# Altium schematic sheet Sensor Signal.SchDoc
size A2; SheetNumber: 2; SheetTotal: 3
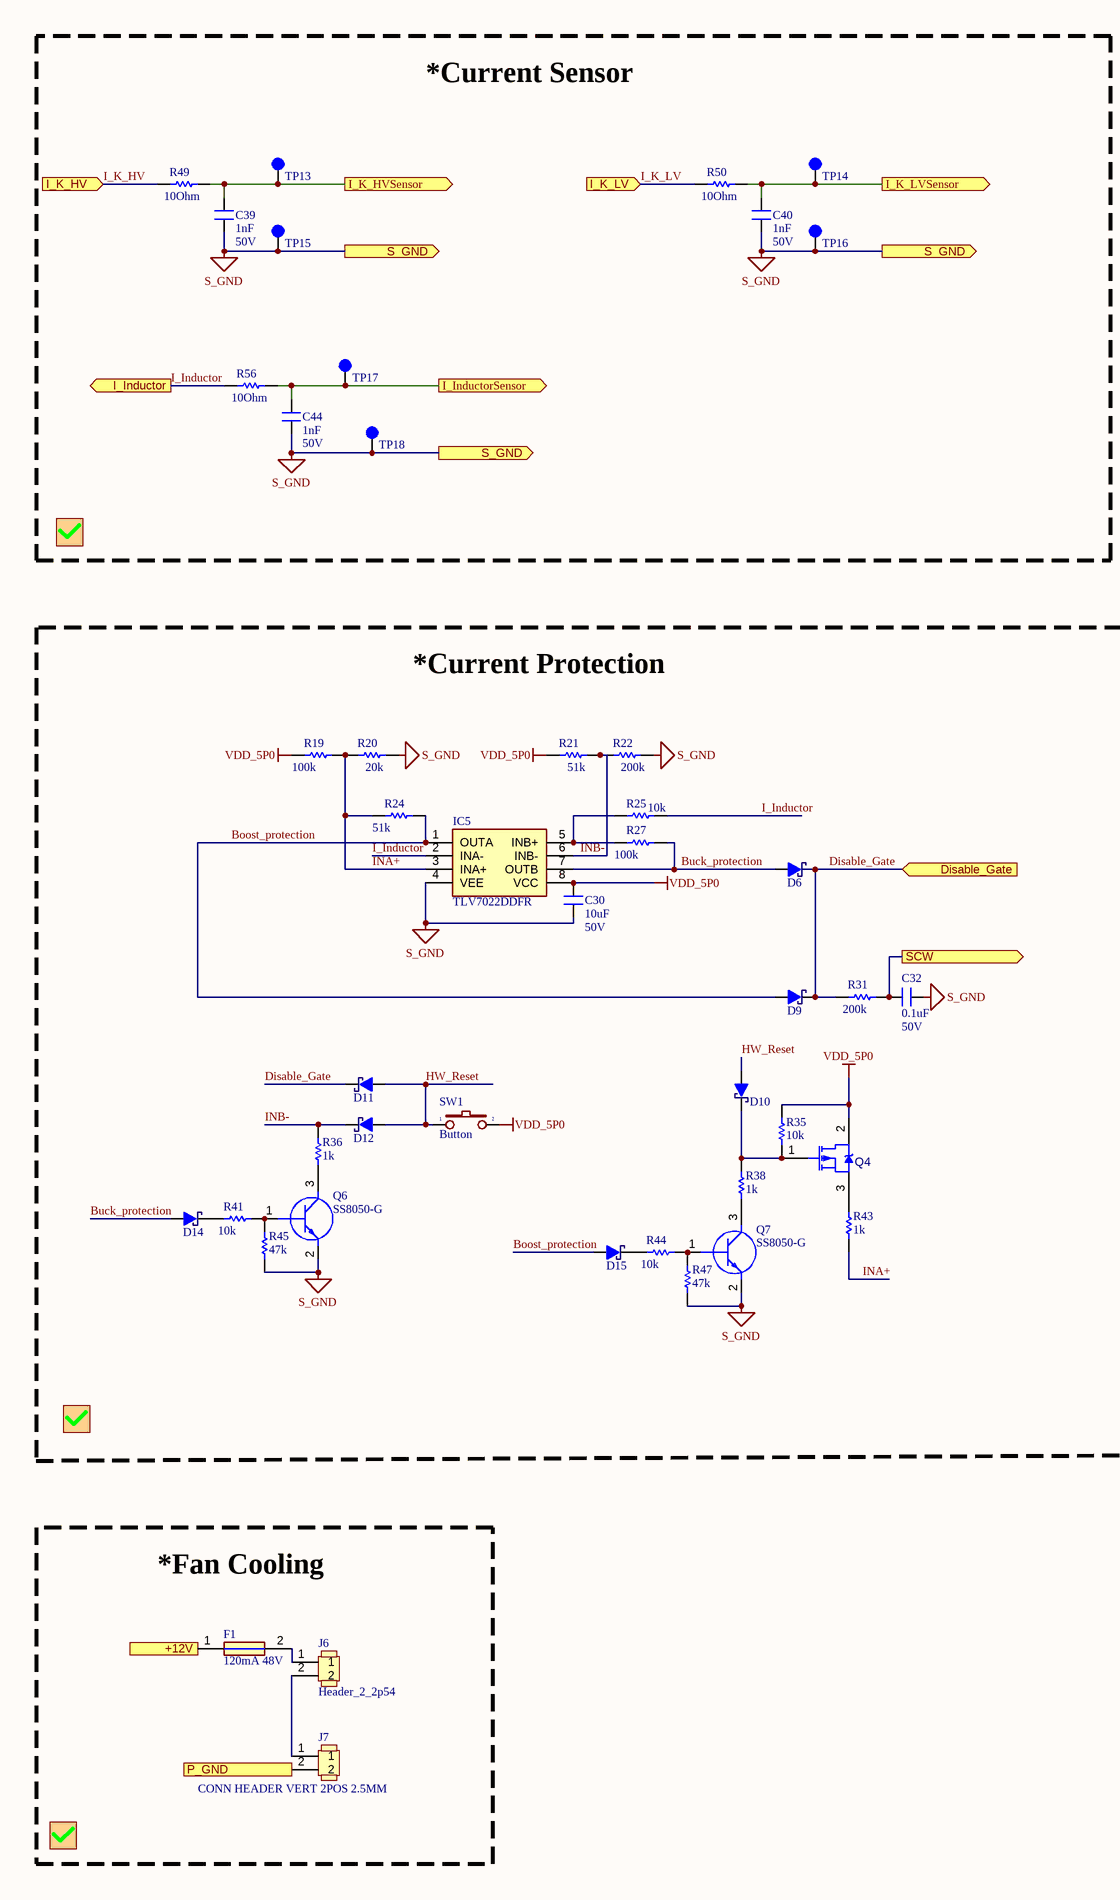
[diagram p0: Sensor Signal.SchDoc, left]
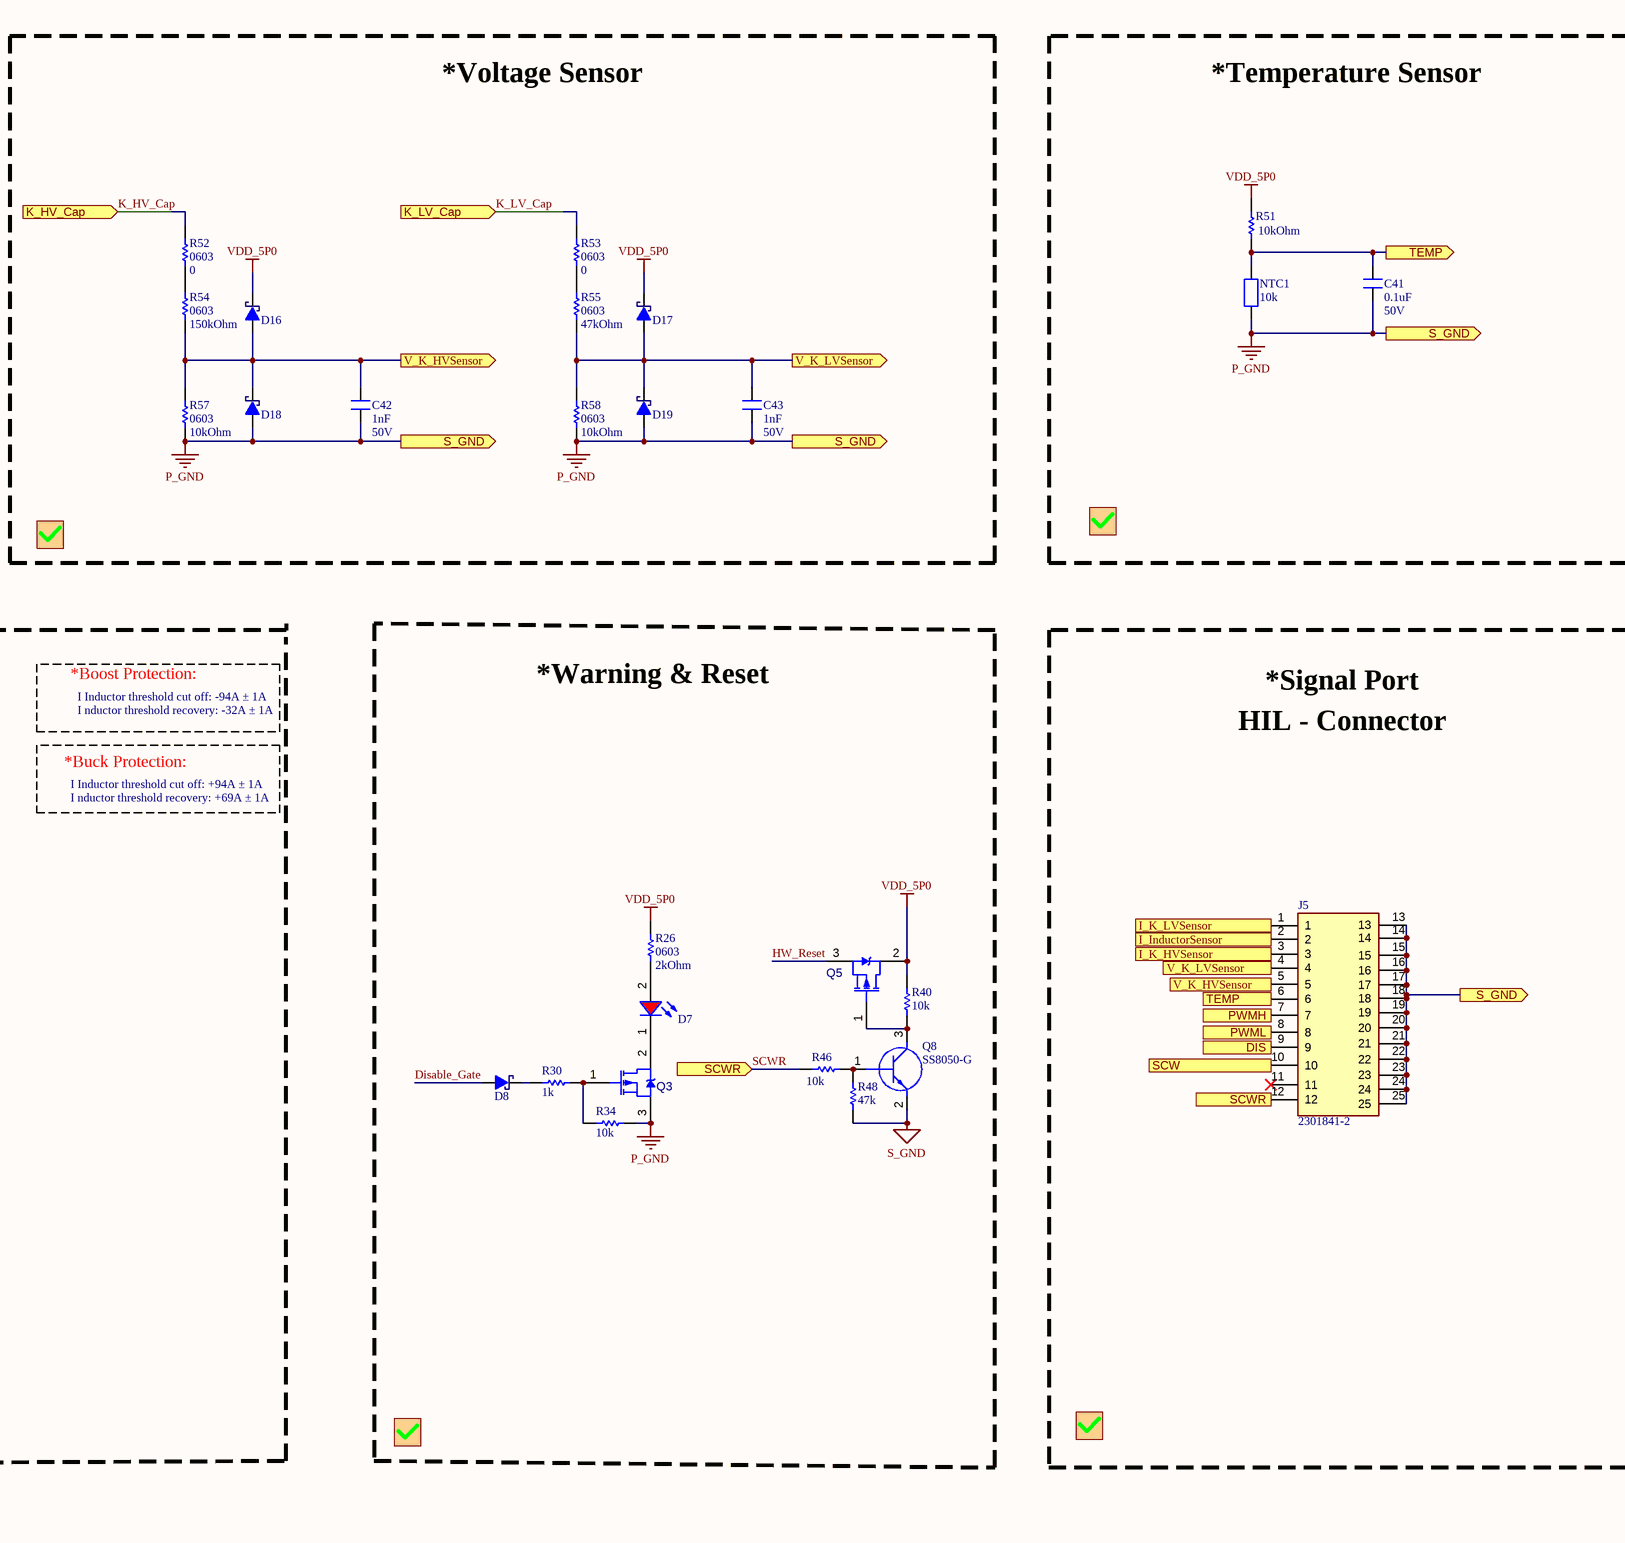
[diagram p1: Sensor Signal.SchDoc, right]

## Parts
C30  10uF  value 50V  [C_0603]
C32  0.1uF  value 50V  [C_0603]
C39  1nF  value 50V  [C_0603]
C40  1nF  value 50V  [C_0603]
C41  0.1uF  value 50V  [C_0603]
C42  1nF  value 50V  [C_0603]
C43  1nF  value 50V  [C_0603]
C44  1nF  value 50V  [C_0603]
D6  PMEG2010AEJ,115  [SOD323F]  (value not drawn)
D7  LED-SMD  [SM-LED-0805-Red]  (value not drawn)
D8  PMEG2010AEJ,115  [SOD323F]  (value not drawn)
D9  PMEG2010AEJ,115  [SOD323F]  (value not drawn)
D10  PMEG2010AEJ,115  [SOD323F]  (value not drawn)
D11  PMEG2010AEJ,115  [SOD323F]  (value not drawn)
D12  PMEG2010AEJ,115  [SOD323F]  (value not drawn)
D14  PMEG2010AEJ,115  [SOD323F]  (value not drawn)
D15  PMEG2010AEJ,115  [SOD323F]  (value not drawn)
D16  PMEG2010AEJ,115  [SOD323F]  (value not drawn)
D17  PMEG2010AEJ,115  [SOD323F]  (value not drawn)
D18  PMEG2010AEJ,115  [SOD323F]  (value not drawn)
D19  PMEG2010AEJ,115  [SOD323F]  (value not drawn)
F1  120mA 48V  [Fuse-SMD-1206]
IC5  TLV7022DDFR  [SOT65P280X110-8N]
J5  2301841-2  [TE_2301841-2]
J6  Header_2_2p54  [JUMP_1x2]
J7  CONN HEADER VERT 2POS 2.5MM  [HEADER_2]
NTC1  10k  [NTC 0805]
Q3  IRLML6402TRPBF  [sot23-3]  (value not drawn)
Q4  IRLML6402TRPBF  [sot23-3]  (value not drawn)
Q5  IRLML6402TRPBF  [sot23-3]  (value not drawn)
Q6  SS8050-G  [sot23-3]
Q7  SS8050-G  [sot23-3]
Q8  SS8050-G  [sot23-3]
R19  value 100k  [R_0603]  (hidden comment: 0603)
R20  value 20k  [R_0603]  (hidden comment: 0603)
R21  51k  [R_0603]
R22  200k  [R_0603]
R24  value 51k  [R_0603]  (hidden comment: 0603)
R25  10k  [R_0603]
R26  0603  value 2kOhm  [R_0603]
R27  value 100k  [R_0603]  (hidden comment: 0603)
R30  1k  [R_0603]
R31  200k  [R_0603]
R34  10k  [R_0603]
R35  10k  [R_0603]
R36  1k  [R_0603]
R38  1k  [R_0603]
R40  10k  [R_0603]
R41  10k  [R_0603]
R43  1k  [R_0603]
R44  10k  [R_0603]
R45  47k  [R_0603]
R46  10k  [R_0603]
R47  47k  [R_0603]
R48  47k  [R_0603]
R49  value 10Ohm  [R_0603]  (hidden comment: 0603)
R50  value 10Ohm  [R_0603]  (hidden comment: 0603)
R51  value 10kOhm  [R_0603]  (hidden comment: 0603)
R52  0603  value 0  [R_0603]
R53  0603  value 0  [R_0603]
R54  0603  value 150kOhm  [R_0603]
R55  0603  value 47kOhm  [R_0603]
R56  value 10Ohm  [R_0603]  (hidden comment: 0603)
R57  0603  value 10kOhm  [R_0603]
R58  0603  value 10kOhm  [R_0603]
SW1  Button  [BUTTON_2P_SMD]
TP13  Test Point  [TP_1mm_through_hole]  (value not drawn)
TP14  Test Point  [TP_1mm_through_hole]  (value not drawn)
TP15  Test Point  [TP_1mm_through_hole]  (value not drawn)
TP16  Test Point  [TP_1mm_through_hole]  (value not drawn)
TP17  Test Point  [TP_1mm_through_hole]  (value not drawn)
TP18  Test Point  [TP_1mm_through_hole]  (value not drawn)

## Blocks framed on the sheet
*Current Sensor: C39 C40 C44 R49 R50 R56 TP13-TP18
*Voltage Sensor: C42 C43 D16-D19 R52-R55 R57 R58
*Temperature Sensor: C41 NTC1 R51
*Warning & Reset: D7 D8 Q3 Q5 Q8 R26 R30 R34 R40 R46 R48
*Fan Cooling: F1 J6 J7

## Ports
+12V (in), DIS (in), Disable_Gate (in), I_Inductor (out), I_InductorSensor (out), I_K_HV (in), I_K_HVSensor (out), I_K_LV (in), I_K_LVSensor (out), K_HV_Cap (in), K_LV_Cap (in), P_GND (in), PWMH (in), PWML (in), S_GND (out), SCW (out), SCWR (in), TEMP (out), V_K_HVSensor (out), V_K_LVSensor (out)

## Nets
P_GND: C30.1 C32.2 C39.1 C40.1 C41.1 C42.1 C43.1 C44.1 D18.1 D19.1 IC5.4(VEE) J5.13 J5.14 J5.15 J5.16 J5.17 J5.18 J5.19 J5.20 J5.21 J5.22 J5.23 J5.24 J5.25 NTC1.1 Q3.3(S) Q6.2(E) Q7.2(E) Q8.2(E) R20.2 R22.2 R34.2 R45.1 R47.1 R48.1 R57.1 R58.1 TP15.1(B) TP16.1(B) TP18.1(B) ; port S_GND  [also labelled S_GND]
VDD_5P0: C30.2 D16.2 D17.2 IC5.8(VCC) Q4.2(D) Q5.2(D) R19.1 R21.1 R26.2 R35.2 R40.2 R51.2 SW1.2
+12V: F1.1 ; port +12V
Boost_protection: D9.1 D15.1 IC5.1(OUTA) R24.2
Buck_protection: D6.1 D14.1 IC5.7(OUTB) R27.2
DIS: J5.9 ; port DIS
Disable_Gate: D6.2 D8.1 D9.2 D11.2 R31.1 ; port Disable_Gate
HW_Reset: D10.1 D11.1 D12.1 Q5.3(S) SW1.1
I_Inductor: IC5.2(INA-) R25.2 R56.1 ; port I_Inductor
I_InductorSensor: C44.2 J5.2 R56.2 TP17.1(B) ; port I_InductorSensor
I_K_HV: R49.1 ; port I_K_HV
I_K_HVSensor: C39.2 J5.3 R49.2 TP13.1(B) ; port I_K_HVSensor
I_K_LV: R50.1 ; port I_K_LV
I_K_LVSensor: C40.2 J5.1 R50.2 TP14.1(B) ; port I_K_LVSensor
INA+: IC5.3(INA+) R19.2 R20.1 R24.1 R43.1
INB-: D12.2 IC5.6(INB-) R21.2 R22.1 R36.2
K_HV_Cap: R52.2 ; port K_HV_Cap
K_LV_Cap: R53.2 ; port K_LV_Cap
P_GND: J7.2 ; port P_GND  [a separate net that carries the same name]
PWMH: J5.7 ; port PWMH
PWML: J5.8 ; port PWML
SCW: C32.1 J5.10 R31.2 ; port SCW
SCWR: J5.12 R46.1 ; port SCWR
TEMP: C41.2 J5.6 NTC1.2 R51.1 ; port TEMP
V_K_HVSensor: C42.2 D16.1 D18.2 J5.5 R54.1 R57.2 ; port V_K_HVSensor
V_K_LVSensor: C43.2 D17.1 D19.2 J5.4 R55.1 R58.2 ; port V_K_LVSensor
NetD7_1: D7.1(K) Q3.2(D)
NetD7_2: D7.2(A) R26.1
NetD8_2: D8.2 R30.2
NetD10_2: D10.2 Q4.1(G) R35.1 R38.2
NetD14_2: D14.2 R41.1
NetD15_2: D15.2 R44.1
NetF1_2: F1.2 J6.1
NetIC5_5: IC5.5(INB+) R25.1 R27.1
NetJ6_2: J6.2 J7.1
NetQ3_1: Q3.1(G) R30.1 R34.1
NetQ4_3: Q4.3(S) R43.2
NetQ5_1: Q5.1(G) Q8.3(C) R40.1
NetQ6_1: Q6.1(B) R41.2 R45.2
NetQ6_3: Q6.3(C) R36.1
NetQ7_1: Q7.1(B) R44.2 R47.2
NetQ7_3: Q7.3(C) R38.1
NetQ8_1: Q8.1(B) R46.2 R48.2
NetR52_1: R52.1 R54.2
NetR53_1: R53.1 R55.2

Not connected (* = marked no-connect by the designer): J5 11*

## Notes on the sheet
- *Current Protection
- *Boost Protection:
- I Inductor threshold cut off: -94A ± 1A
- I nductor threshold recovery: -32A ± 1A
- HIL - Connector
- *Signal Port
- *Buck Protection:
- I Inductor threshold cut off: +94A ± 1A
- I nductor threshold recovery: +69A ± 1A
- Title:
- Project:
- Power Converter Module
- DC/DC Bidirectional Converter
- Revision:
- CLA Power Electronics
- 36 Xuan Thuy, Dich Vong Hau
- Draw:
- File Name:
- AnhDT
- Check:
- Approve:
- Sheet:
- 1
- Size:
- of
- A2
- Modified Date:
- Cau Giay - Ha Noi
- Time:
- Date:
- ©2023

## Library data of the parts
C30 = Cap_Cer_0603_1nF_25V: CAP CER 10UF 16V X5R 0805; Manufacturer: Murata Electronics; Part Number: CL21A106KOCLRNC; Part Code: S1200-000082; Point: 2; Description SEL: CAP CER 10UF 16V X5R 0805; Footprint Type: SMD
C32 = Cap_Cer_0603_1nF_25V: CAP CER 0.1UF 16V X5R 0603; Manufacturer: Murata Electronics; Part Number: CL21A106KOCLRNC; Part Code: S1200-000082; Description SEL: CAP CER 10UF 16V X5R 0805; Point: 2; Footprint Type: SMD
C39 C40 C42-C44 = Cap_Cer_0603_1nF_25V: CAP CER 1nF 50V X7R 0603; Manufacturer: Murata Electronics; Part Number: GCM188R71E102KA37D; Part Code: S1200-000082; Description SEL: CAP CER 1000PF 25V X7R 0603; Point: 2; Footprint Type: SMD
C41 = Cap_Cer_0805_10pF: CAP CER 0.1uF 50V X7R 0603; Manufacturer: Kemet; Part Number: CL10C680JB81PNC; Part Code: S1200-000116; Description SEL: CAP CER 68pF 50V C0G 0603; Point: 2; Footprint Type: SMD
D6 D8-D12 D14-D19 = PMEG2010AEJ,115: DIODE SCHOTTKY 20V 1A SOD323F; Manufacturer: Nexperia USA Inc.; Current: 1A (DC); Category: DIODE; Part Number: PMEG2010AEJ,115; Footprint/Package: SOD-323F; Footprint type: SMD; Voltage: 20 V
D7 = LED-SMD: LED RED DIFFUSED 0805 SMD; Manufacturer: OSRAM Opto Semiconductors Inc.; Part Number: LS R976-NR-1; Category: LED; Footprint type: SMD
F1 = Fuse: PTC 120mA 48V 2410; Manufacturer_Name: Bel Circuit Protection; Manufacturer_Part_Number: 0679L1000-01; Datasheet Link: https://belfuse.com/resources/datasheets/circuitprotection/ds-cp-0679l-series.pdf; Height: 2.79mm; Arrow Part Number: 0679L1000-01; Arrow Price/Stock: https://www.arrow.com/en/products/0679l1000-01/bel-group
IC5 = TLV7022DDFR: IC COMPARATOR 2 GEN PUR TSOT23-8; Manufacturer_Name: Texas Instruments; Height: 1.1mm; Part Number: TLV7022DDFR; Mouser Part Number: 595-TLV7022DDFR; Mouser Price/Stock: https://www.mouser.co.uk/ProductDetail/Texas-Instruments/TLV7022DDFR?qs=DPoM0jnrROVunnoIjN7Ztg%3D%3D; Arrow Part Number: TLV7022DDFR; Arrow Price/Stock: https://www.arrow.com/en/products/tlv7022ddfr/texas-instruments?region=nac
J5 = 2301841-2: 25 Position D-Sub Receptacle, Female Sockets Connector; MF: TE Connectivity; Package: None; Value: *; TE_purchase_URL: https://www.te.com/usa-en/product-2301841-2.html?te_bu=Cor&te_type=disp&te_campaign=seda_glo_cor-seda-global-disp-prtnr-fy19-seda-model-bom-cta_sma-317_1&elqCampaignId=32493; Price: None; MP: 2301841-2; SnapEDA_Link: https://www.snapeda.com/parts/2301841-2/TE%20Connectivity%20AMP%20Connectors/view-part/3597269/?ref=snap; Availability: Unavailable
J6 = Header_2_2p54: Part Code: S1900-000020; Point: 2; Manufacturer: *; Part Number: *; Value: *; Description SEL: Header_2_2p54; Footprint Type: TH
J7 = Header_2: Part Code: S1900-000037; Manufacturer: JST Sales America Inc.; Part Number: B2B-XH-A(LF)(SN); Point: 2; Value: Header_2; Description SEL: CONN HEADER VERT 2POS 2.5MM; Footprint Type: TH
NTC1 = NTC 10k 1%: THERMISTOR NTC 10KOHM 3940K 0805; Manufacturer: Vishay Beyschlag/Draloric/BC Components; Part Number: NTCS0805E3103JHT; Part Code: S1100-000169; Point: 2; Power: 1/10W; Tolerance: 0.1%; Description SEL: THERMISTOR NTC 10KOHM 3940K 0805; Footprint Type: SMD
Q3 = S1555-000011: MOSFET N-CH 20V 3.7A; pin to pad: 2>3 3>2; Manufacturer: INFINEON; Part Number: DMP2160U-7; Description SEL: P-Channel 20 V 3.7A (Ta) 1.3W (Ta) Surface Mount Micro3™/SOT-23; Point: 3; Value: 20V 3.7A; Footprint Type: SMD; Part Code: S1555-000011; Packaging: SOT23-3; Component Kind: Standard; Footprint: SOT23-3
Q4 Q5 = S1555-000011: MOSFET P-CH 20V 3.7A; Manufacturer: INFINEON; Description SEL: P-Channel 20 V 3.7A (Ta) 1.3W (Ta) Surface Mount Micro3™/SOT-23; Point: 3; Part Number: IRLML6402; Value: 20V 3.7A; Footprint Type: SMD; Part Code: S1555-000011; Packaging: SOT23-3; Component Kind: Standard; Footprint: SOT23-3
Q6-Q8 = SS8050-G: Transistor BJT NPN; Manufacturer_Name: Comchip Technology; Datasheet Link: https://datasheet.datasheetarchive.com/originals/distributors/DKDS-12/229454.pdf; Height: 1.15mm; Manufacturer_Part_Number: SS8050-G; Mouser Part Number: 750-SS8050-G; Mouser Price/Stock: https://www.mouser.co.uk/ProductDetail/Comchip-Technology/SS8050-G?qs=LLUE9lz1YbcHg%252BWLMAtcrQ%3D%3D; Arrow Part Number: SS8050-G; Arrow Price/Stock: https://www.arrow.com/en/products/ss8050-g/comchip-technology?region=nac
R19 R27 = Resistor_0603_1_MegaOhm_1%: RES 100k OHM 1% 1/10W 0603; Manufacturer: YAGEO; Part Number: RC0603FR-071ML; Part Code: S1100-000171; Description SEL: RES 1M OHM 1% 1/10W 0603; Point: 2; Footprint Type: SMD; Power: 1/10W; Tolerance: 1%
R20 = Resistor_0603_1_MegaOhm_1%: RES 20k OHM 1% 1/10W 0603; Manufacturer: YAGEO; Part Number: RC0603FR-071ML; Part Code: S1100-000171; Description SEL: RES 1M OHM 1% 1/10W 0603; Point: 2; Footprint Type: SMD; Power: 1/10W; Tolerance: 1%
R21 = Resistor_0603_10Ohm 1%: RES 51k OHM 1% 1/8W 0603; Manufacturer: KOA Speer Electronics, Inc.; Part Number: RT0603FRE07300KL; Part Code: S1100-000044; Description SEL: RES 300k OHM 1% 1/8W 0603; Point: 2; Footprint Type: SMD; Power: 1/8W; Tolerance: 1%
R22 = Resistor_0603_10Ohm 1%: RES 200k OHM 1% 1/8W 0603; Manufacturer: KOA Speer Electronics, Inc.; Part Number: RT0603FRE07300KL; Part Code: S1100-000044; Description SEL: RES 300k OHM 1% 1/8W 0603; Point: 2; Footprint Type: SMD; Power: 1/8W; Tolerance: 1%
R24 = Resistor_0603_1_MegaOhm_1%: RES 51k OHM 1% 1/10W 0603; Manufacturer: YAGEO; Part Number: RC0603FR-071ML; Part Code: S1100-000171; Description SEL: RES 1M OHM 1% 1/10W 0603; Point: 2; Footprint Type: SMD; Power: 1/10W; Tolerance: 1%
R25 = Resistor_0603_10Ohm 1%: RES 10k OHM 1% 1/8W 0603; Manufacturer: KOA Speer Electronics, Inc.; Part Number: RNCF0805BTE250K; Part Code: S1100-000044; Description SEL: RES 250k OHM 1% 1/8W 0603; Point: 2; Footprint Type: SMD; Power: 1/8W; Tolerance: 1%
R26 = Resistor_0603_4.7kOhm: RES 2K OHM 1% 1/10W 0603; Manufacturer: YAGEO; Part Number: RC0603FR-074K7L; Part Code: S1100-000158; Description SEL: RES 4.7K OHM 1% 1/10W 0603; Point: 2; Footprint Type: SMD; Power: 1/10W; Tolerance: 1%
R30 R31 R38 R43 = Resistor_0603_10Ohm 1%: RES 200K OHM 1% 1/10W 0603; Manufacturer: YAGEO; Part Number: RC0603FR-13200KL; Part Code: S1100-000044; Point: 2; Power: 1/8W; Description SEL: RES 200K OHM 1% 1/10W 0603; Footprint Type: SMD; Tolerance: 1%
R34 R41 R44 R46 = Resistor_0603_10Ohm 1%: RES 10K OHM 1% 1/10W 0603; Manufacturer: YAGEO; Part Number: RC0603FR-13200KL; Part Code: S1100-000044; Description SEL: RES 200K OHM 1% 1/10W 0603; Point: 2; Power: 1/8W; Footprint Type: SMD; Tolerance: 1%
R35 R40 R45 R47 R48 = Resistor_0603_10Ohm 1%: RES 47K OHM 1% 1/10W 0603; Manufacturer: YAGEO; Part Number: RC0603FR-13200KL; Part Code: S1100-000044; Description SEL: RES 200K OHM 1% 1/10W 0603; Point: 2; Power: 1/8W; Footprint Type: SMD; Tolerance: 1%
R36 = Resistor_0603_10Ohm 1%: RES 1K OHM 1% 1/10W 0603; Manufacturer: YAGEO; Part Number: RC0603FR-13200KL; Part Code: S1100-000044; Description SEL: RES 200K OHM 1% 1/10W 0603; Point: 2; Power: 1/8W; Footprint Type: SMD; Tolerance: 1%
R49 R50 R56 = Resistor_0603_1kOhm: RES 10 OHM 1% 1/10W 0603; Manufacturer: Vishay Dale; Part Number: CRCW06031K00FKTA; Part Code: S1100-000139; Description SEL: RES 1K OHM 1% 1/10W 0603; Point: 2; Footprint Type: SMD; Power: 1/10W; Tolerance: 1%
R51 = Resistor_0603_10kOhm 1%: RES 10K OHM 1% 1/10W 0603; Manufacturer: YAGEO; Part Number: RC0603FR-7W10KL; Part Code: S1100-000043; Point: 2; Description SEL: RES 10K OHM 1% 1/10W 0603; Footprint Type: SMD; Power: 1/10W; Tolerance: 1%
R52 R53 = Resistor_0603_220kOhm: RES SMD 0 OHM 1% 1/8W 0603; Manufacturer: Vishay Beyschlag/Draloric/BC Components; Part Number: MCT06030C2203FP500; Part Code: S1100-000053; Description SEL: RES SMD 220K OHM 1% 1/8W 0603; Point: 2; Footprint Type: SMD; Power: 1/8W; Tolerance: 1%
R54 R55 = Resistor_0603_220kOhm: RES SMD 150K OHM 1% 1/8W 0603; Manufacturer: Vishay Beyschlag/Draloric/BC Components; Part Number: MCT06030C2203FP500; Part Code: S1100-000053; Description SEL: RES SMD 220K OHM 1% 1/8W 0603; Point: 2; Footprint Type: SMD; Power: 1/8W; Tolerance: 1%
R57 R58 = Resistor_0603_220kOhm: RES SMD 220K OHM 1% 1/8W 0603; Manufacturer: Vishay Beyschlag/Draloric/BC Components; Part Number: MCT06030C2203FP500; Part Code: S1100-000053; Point: 2; Description SEL: RES SMD 220K OHM 1% 1/8W 0603; Footprint Type: SMD; Power: 1/8W; Tolerance: 1%
SW1 = SW2: Nút nhấn 2 chân dán 3x6x2.5mm; Category: Connector
TP13-TP18 = Test Point: PC TEST POINT COMPACT RED; Part Number: 5005; Manufacturer: Keystone Electronics